# Altium schematic sheet FPGA Data.SchDoc
size E
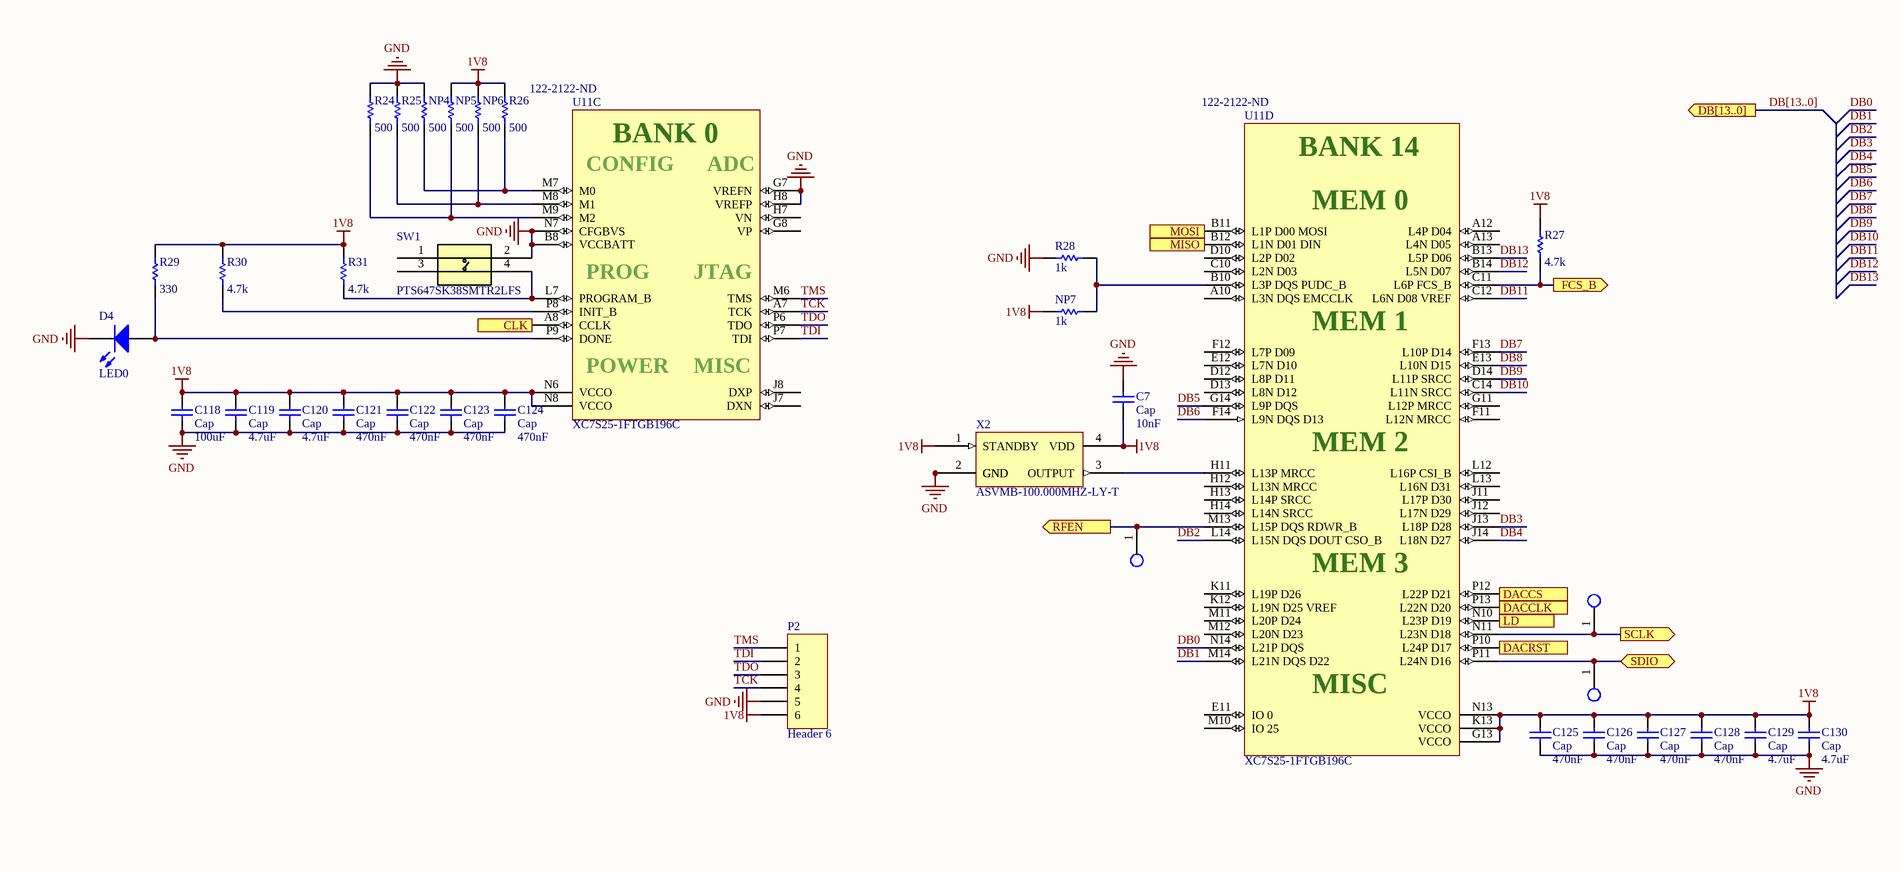
[diagram p0: FPGA Data.SchDoc, left]
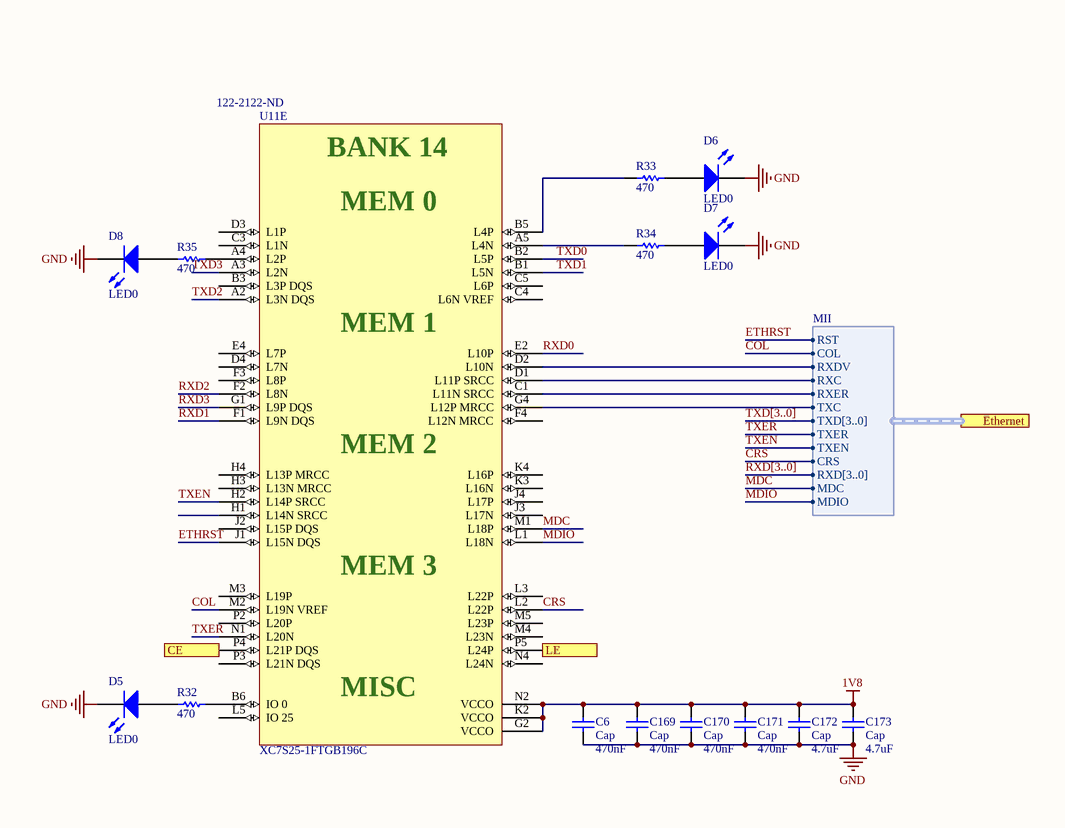
[diagram p1: FPGA Data.SchDoc, right]

## Parts
C6  Cap  value 470nF  [1608[0603]]
C7  Cap  value 10nF  [0402-A]
C118  Cap  value 100uF  [C1210]
C119  Cap  value 4.7uF  [6-0805_M]
C120  Cap  value 4.7uF  [6-0805_M]
C121  Cap  value 470nF  [1608[0603]]
C122  Cap  value 470nF  [1608[0603]]
C123  Cap  value 470nF  [1608[0603]]
C124  Cap  value 470nF  [1608[0603]]
C125  Cap  value 470nF  [1608[0603]]
C126  Cap  value 470nF  [1608[0603]]
C127  Cap  value 470nF  [1608[0603]]
C128  Cap  value 470nF  [1608[0603]]
C129  Cap  value 4.7uF  [6-0805_M]
C130  Cap  value 4.7uF  [6-0805_M]
C169  Cap  value 470nF  [1608[0603]]
C170  Cap  value 470nF  [1608[0603]]
C171  Cap  value 470nF  [1608[0603]]
C172  Cap  value 4.7uF  [6-0805_M]
C173  Cap  value 4.7uF  [6-0805_M]
CLK1  5029  [EXPOSED PAD 0.02X0.02]  (value not drawn)
CLK2  5029  [EXPOSED PAD 0.02X0.02]  (value not drawn)
CLK8  5029  [EXPOSED PAD 0.02X0.02]  (value not drawn)
D4  LED0  [1608[0603]]
D5  LED0  [1608[0603]]
D6  LED0  [1608[0603]]
D7  LED0  [1608[0603]]
D8  LED0  [1608[0603]]
NP4  value 500  [0402-A]  (hidden comment: Res1)
NP5  value 500  [0402-A]  (hidden comment: Res1)
NP6  value 500  [0402-A]  (hidden comment: Res1)
NP7  value 1k  [0402-A]  (hidden comment: Res1)
P2  Header 6  [HDR1X6]
R24  value 500  [0402-A]  (hidden comment: Res1)
R25  value 500  [0402-A]  (hidden comment: Res1)
R26  value 500  [0402-A]  (hidden comment: Res1)
R27  value 4.7k  [0402-A]  (hidden comment: Res1)
R28  value 1k  [0402-A]  (hidden comment: Res1)
R29  value 330  [0402-A]  (hidden comment: Res1)
R30  value 4.7k  [0402-A]  (hidden comment: Res1)
R31  value 4.7k  [0402-A]  (hidden comment: Res1)
R32  value 470  [0402-A]  (hidden comment: Res1)
R33  value 470  [0402-A]  (hidden comment: Res1)
R34  value 470  [0402-A]  (hidden comment: Res1)
R35  value 470  [0402-A]  (hidden comment: Res1)
SW1  PTS647SK38SMTR2LFS  [PTS647SK38SMTR2LFS_CNK]
U11  XC7S25-1FTGB196C  Supplier Part Number 1: 122-2122-ND  [FTGB196 Package]  (parts C,D,E of 5)
X2  ASVMB-100.000MHZ-LY-T  [ASVMB-100.000MHZ-LY-T]

## Ports
CE (out), CLK (out), DACCLK (out), DACCS (out), DACRST (out), DB[13..0] (out), Ethernet (harness MII), FCS_B (out), LD (in), LE (out), MISO (in), MOSI (out), RFEN (out), SCLK (out), SDIO (bidir)

## Harnesses
MII: RST, COL, CRS, TXER, TXC, TXEN, TXD[3..0], RXER, RXC, RXDV, RXD[3..0], MDC, MDIO

## Nets
1V8: C6.2 C7.1 C118.2 C119.2 C120.2 C121.2 C122.2 C123.2 C124.2 C125.2 C126.2 C127.2 C128.2 C129.2 C130.2 C169.2 C170.2 C171.2 C172.2 C173.2 NP5.2 NP6.2 NP7.2 P2.6 R26.2 R27.2 R29.2 R30.2 R31.2 U11.G2(VCCO) U11.G13(VCCO) U11.K2(VCCO) U11.K13(VCCO) U11.N2(VCCO) U11.N6(VCCO) U11.N8(VCCO) U11.N13(VCCO) X2.1(STANDBY) X2.4(VDD)
GND: C6.1 C7.2 C118.1 C119.1 C120.1 C121.1 C122.1 C123.1 C124.1 C125.1 C126.1 C127.1 C128.1 C129.1 C130.1 C169.1 C170.1 C171.1 C172.1 C173.1 D4.2(K) D5.2(K) D6.2(K) D7.2(K) D8.2(K) NP4.2 P2.5 R24.2 R25.2 R28.2 SW1.2 U11.B8(VCCBATT) U11.G7(VREFN) U11.H8(VREFP) U11.N7(CFGBVS) X2.2(GND) X2.5(GND)
CE: U11.P4(L21P_DQS) ; port CE
CLK: U11.A8(CCLK) ; port CLK
COL: U11.M2(L19N_VREF) ; port Ethernet.COL
CRS: U11.L2(L22P) ; port Ethernet.CRS
DACCLK: U11.P13(L22N_D20) ; port DACCLK
DACCS: U11.P12(L22P_D21) ; port DACCS
DACRST: U11.P10(L24P_D17) ; port DACRST
DB0: U11.N14(L21P_DQS)
DB1: U11.M14(L21N_DQS_D22)
DB2: U11.L14(L15N_DQS_DOUT_CSO_B)
DB3: U11.J13(L18P_D28)
DB4: U11.J14(L18N_D27)
DB5: U11.G14(L9P_DQS)
DB6: U11.F14(L9N_DQS_D13)
DB7: U11.F13(L10P_D14)
DB8: U11.E13(L10N_D15)
DB9: U11.D14(L11P_SRCC)
DB10: U11.C14(L11N_SRCC)
DB11: U11.C12(L6N_D08_VREF)
DB12: U11.B14(L5N_D07)
DB13: U11.B13(L5P_D06)
ETHRST: U11.J1(L15N_DQS) ; port Ethernet.RST
FCS_B: R27.1 U11.C11(L6P_FCS_B) ; port FCS_B
LD: U11.N10(L23P_D19) ; port LD
LE: U11.P5(L24P) ; port LE
MDC: U11.M1(L18P) ; port Ethernet.MDC
MDIO: U11.L1(L18N) ; port Ethernet.MDIO
MISO: U11.B12(L1N_D01_DIN) ; port MISO
MOSI: U11.B11(L1P_D00_MOSI) ; port MOSI
RFEN: CLK8.1 U11.M13(L15P_DQS_RDWR_B) ; port RFEN
RXD0: U11.E2(L10P)
RXD1: U11.F1(L9N_DQS)
RXD2: U11.F2(L8N)
RXD3: U11.G1(L9P_DQS)
SCLK: CLK1.1 U11.N11(L23N_D18) ; port SCLK
SDIO: CLK2.1 U11.P11(L24N_D16) ; port SDIO
TCK: P2.4 U11.A7(TCK)
TDI: P2.2 U11.P7(TDI)
TDO: P2.3 U11.P6(TDO)
TMS: P2.1 U11.M6(TMS)
TXD0: U11.B2(L5P)
TXD1: U11.B1(L5N)
TXD2: U11.A2(L3N_DQS)
TXD3: U11.A3(L2N)
TXEN: U11.H2(L14P_SRCC) ; port Ethernet.TXEN
TXER: U11.N1(L20N) ; port Ethernet.TXER
NetD4_1: D4.1(A) R29.1 U11.P9(DONE)
NetD5_1: D5.1(A) R32.2
NetD6_1: D6.1(A) R33.2
NetD7_1: D7.1(A) R34.2
NetD8_1: D8.1(A) R35.2
NetNP4_1: NP4.1 R26.1 U11.M7(M0)
NetNP5_1: NP5.1 R24.1 U11.M9(M2)
NetNP6_1: NP6.1 R25.1 U11.M8(M1)
NetNP7_1: NP7.1 R28.1 U11.B10(L3P_DQS_PUDC_B)
NetR30_1: R30.1 U11.P8(INIT_B)
NetR31_1: R31.1 SW1.4 U11.L7(PROGRAM_B)
NetR32_1: R32.1 U11.B6(IO_0)
NetR33_1: R33.1 U11.B5(L4P)
NetR34_1: R34.1 U11.A5(L4N)
NetR35_1: R35.1 U11.A4(L2P)
NetU11_C1: U11.C1(L11N_SRCC) ; port Ethernet.RXER
NetU11_D1: U11.D1(L11P_SRCC) ; port Ethernet.RXC
NetU11_D2: U11.D2(L10N) ; port Ethernet.RXDV
NetU11_G4: U11.G4(L12P_MRCC) ; port Ethernet.TXC
NetU11_H11: U11.H11(L13P_MRCC) X2.3(OUTPUT)

Not connected (* = marked no-connect by the designer): SW1 1 3; U11 A10(L3N_DQS_EMCCLK) A12(L4P_D04) A13(L4N_D05) B3(L3P_DQS) C3(L1N) C4(L6N_VREF) C5(L6P) C10(L2N_D03) D3(L1P) D4(L7N) D10(L2P_D02) D12(L8P_D11) D13(L8N_D12) E4(L7P) E11(IO_0) E12(L7N_D10) F3(L8P) F4(L12N_MRCC) F11(L12N_MRCC) F12(L7P_D09) G8(VP) G11(L12P_MRCC) H1(L14N_SRCC) H3(L13N_MRCC) H4(L13P_MRCC) H7(VN) H12(L13N_MRCC) H13(L14P_SRCC) H14(L14N_SRCC) J2(L15P_DQS) J3(L17N) J4(L17P) J7(DXN) J8(DXP) J11(L17P_D30) J12(L17N_D29) K3(L16N) K4(L16P) K11(L19P_D26) K12(L19N_D25_VREF) L3(L22P) L5(IO_25) L12(L16P_CSI_B) L13(L16N_D31) M3(L19P) M4(L23N) M5(L23P) M10(IO_25) M11(L20P_D24) M12(L20N_D23) N4(L24N) P2(L20P) P3(L21N_DQS)

## Buses and harness runs
bus DB[13..0] = port DB[13..0]
bus RXD[3..0]
bus TXD[3..0]

## Notes on the sheet
- (in symbol XC7S25-1FTGB196C, part C) BANK 0; CONFIG; ADC; PROG; JTAG; POWER; MISC
- (in symbol XC7S25-1FTGB196C, part D) BANK 14; MEM 0; MEM 1; MEM 2; MEM 3; MISC
- (in symbol XC7S25-1FTGB196C, part E) BANK 14; MEM 0; MEM 1; MEM 2; MEM 3; MISC

## Library data of the parts
C6 C7 C118-C130 C169-C173 = Cap: Capacitor; Published: 8-Jun-2000; LatestRevisionDate: 17-Jul-2002; LatestRevisionNote: Re-released for DXP Platform.; PackageReference: RAD-0.3; Publisher: Altium Limited; PackageDescription: Radial Cap, Thru-Hole; 2 Leads; 0.3 in Pin Spacing
  C118: ComponentLink1Description: New link; ComponentLink1URL: *; Supplier 1: Digi-Key; Supplier Part Number 1: 490-9969-1-ND
  C119 C120 C129 C130 C172 C173: Supplier 1: Digi-Key; Supplier Part Number 1: 490-14466-1-ND
NP4-NP7 R24-R35 = Res1: Resistor; Published: 8-Jun-2000; LatestRevisionDate: 17-Jul-2002; LatestRevisionNote: Re-released for DXP Platform.; PackageReference: AXIAL-0.3; Publisher: Altium Limited; PackageDescription: Axial Device, Thru-Hole; 2 Leads; 0.3 in Pin Spacing
P2 = Header 6: Header, 6-Pin; LatestRevisionDate: 17-Jul-2002; LatestRevisionNote: Re-released for DXP Platform.; Publisher: Altium Limited
SW1 = PTS647SK38SMTR2LFS: No Description Available; Vendor: C&K; Built_By: EMA_Cory; SourceLibrary: C&K_2020-05-06; Datasheet: https://www.ckswitches.com/media/2567/pts647.pdf; Manufacturer_Part_Number: PTS647SK38SMTR2LFS; Copyright: Copyright (C) 2018 Accelerated Designs. All rights reserved; RefDes: RefDes; Type: DEV; Supplier 1: Digi-Key; Supplier Part Number 1: PTS647SK38SMTR2LFSCT-ND
D4-D8 = LED0: Published: 8-Jun-2000; LatestRevisionDate: 08-Jul-2005; LatestRevisionNote: Mech Layer 1 removed.; PackageReference: LED-0; Publisher: Altium Limited; PackageDescription: LED; 2 Leads
U11 = XC7S25-1FTGB196C: Supplier 1: Digi-Key